# Altium schematic sheet RadarControl_V1.00.SchDoc
size A3
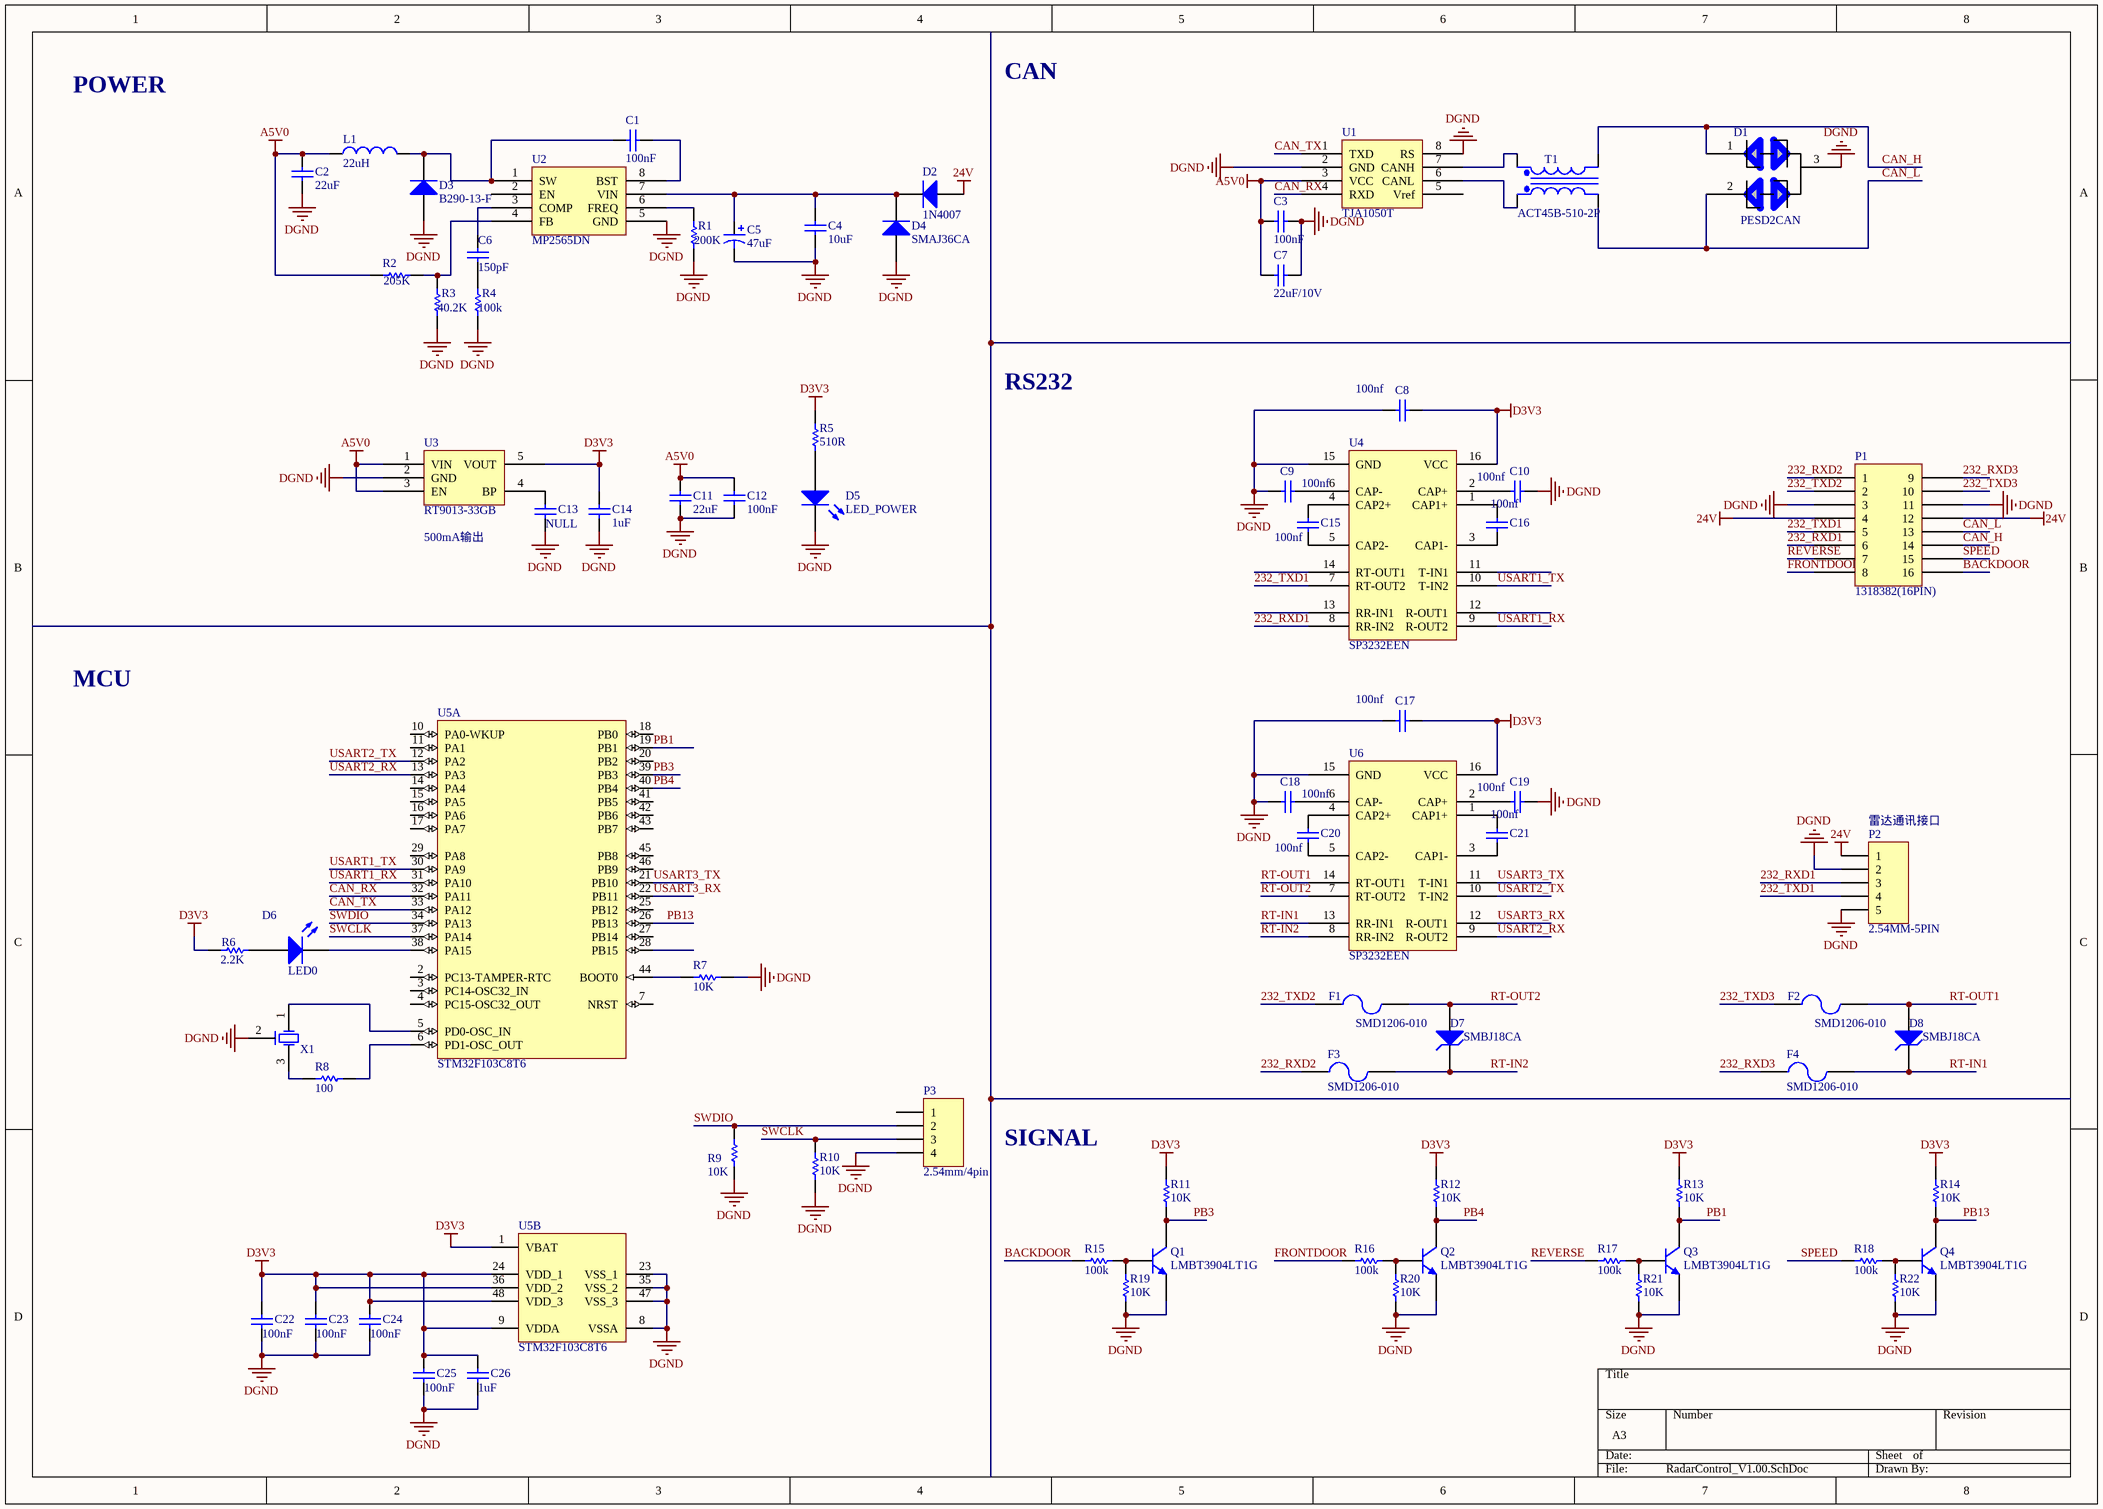
[diagram p0: RadarControl_V1.00.SchDoc]

## Parts
C1  100nF  [0603]
C2  22uF  [0805]
C3  100nF  [0603]
C4  10uF  [0805]
C5  47uF  [cap_pol_8*10.2]
C6  150pF  [0603]
C7  22uF/10V  [0603]
C8  100nf  [0603]
C9  100nf  [0603]
C10  100nf  [0603]
C11  22uF  [1206]
C12  100nF  [0402]
C13  NULL  [0402]
C14  1uF  [0402]
C15  100nf  [0603]
C16  100nf  [0603]
C17  100nf  [0603]
C18  100nf  [0603]
C19  100nf  [0603]
C20  100nf  [0603]
C21  100nf  [0603]
C22  100nF  [0603]
C23  100nF  [0603]
C24  100nF  [0603]
C25  100nF  [0603]
C26  1uF  [0603]
D1  PESD2CAN  [SOT23]
D2  1N4007  [6032_pol]
D3  B290-13-F  [B290]
D4  SMAJ36CA  [B290]
D5  LED_POWER  [0805-LED]
D6  LED0  [0805-LED]
D7  SMBJ18CA  [SMB]
D8  SMBJ18CA  [SMB]
F1  SMD1206-010  [1206]
F2  SMD1206-010  [1206]
F3  SMD1206-010  [1206]
F4  SMD1206-010  [1206]
L1  22uH  [10*10Inductor]
P1  1318382(16PIN)  [16pin 1318382]
P2  2.54MM-5PIN  [HDR1X6]
P3  2.54mm/4pin  [HDR1X4]
Q1  LMBT3904LT1G  [LC-SOT-23(SOT-23-3)]
Q2  LMBT3904LT1G  [LC-SOT-23(SOT-23-3)]
Q3  LMBT3904LT1G  [LC-SOT-23(SOT-23-3)]
Q4  LMBT3904LT1G  [LC-SOT-23(SOT-23-3)]
R1  200K  [0402]
R2  205K  [0603]
R3  40.2K  [0603]
R4  100k  [0603]
R5  510R  [0603]
R6  2.2K  [0603]
R7  10K  [0603]
R8  100  [0603]
R9  value 10K  [0603]  (hidden comment: 1K)
R10  value 10K  [0603]  (hidden comment: 1K)
R11  10K  [0603]
R12  10K  [0603]
R13  10K  [0603]
R14  10K  [0603]
R15  100k  [0603]
R16  100k  [0603]
R17  100k  [0603]
R18  100k  [0603]
R19  10K  [0603]
R20  10K  [0603]
R21  10K  [0603]
R22  10K  [0603]
T1  ACT45B-510-2P  [ACT45B-510-2P]
U1  TJA1050T  [SO8]
U2  MP2565DN  [so-8]
U3  RT9013-33GB  [SOT-23-5]
U4  SP3232EEN  [SO-16]
U5  STM32F103C8T6  [STM-LQFP48_M]  (parts A,B of 2)
U6  SP3232EEN  [SO-16]
X1  8M smd  [8M]  (value not drawn)

## Nets
24V: D2.1(A) P1.4 P1.12 P2.1
A5V0: C2.2 C3.1 C7.1 C11.1 C12.2 L1.1 R2.2 U1.3(VCC) U3.1(VIN) U3.3(EN)
D3V3: C8.2 C14.2 C17.2 C22.2 C23.2 C24.2 C25.2 C26.2 R5.2 R6.2 R11.2 R12.2 R13.2 R14.2 U3.5(VOUT) U4.16(VCC) U5.1(VBAT) U5.9(VDDA) U5.24(VDD_1) U5.36(VDD_2) U5.48(VDD_3) U6.16(VCC)
DGND: C2.1 C3.2 C4.1 C5.2 C7.2 C8.1 C9.1 C10.1 C11.2 C12.1 C13.1 C14.1 C17.1 C18.1 C19.1 C22.1 C23.1 C24.1 C25.1 C26.1 D1.3 D3.1(A) D4.1(A) D5.2(K) P1.3 P1.11 P2.2 P2.5 P3.4 Q1.1(E) Q2.1(E) Q3.1(E) Q4.1(E) R1.1 R3.1 R4.1 R7.2 R9.2 R10.2 R19.1 R20.1 R21.1 R22.1 U1.2(GND) U1.8(RS) U2.5(GND) U3.2(GND) U4.15(GND) U5.8(VSSA) U5.23(VSS_1) U5.35(VSS_2) U5.47(VSS_3) U6.15(GND) X1.2(GND)
232_RXD1: P1.6 P2.3 U4.8(RR-IN2)
232_RXD2: F3.1 P1.1
232_RXD3: F4.1 P1.9
232_TXD1: P1.5 P2.4 U4.7(RT-OUT2)
232_TXD2: F1.1 P1.2
232_TXD3: F2.1 P1.10
BACKDOOR: P1.16 R15.2
CAN_H: D1.1 P1.14 T1.4(Sec-)
CAN_L: D1.2 P1.13 T1.2(Pri-)
CAN_RX: U1.4(RXD) U5.32(PA11)
CAN_TX: U1.1(TXD) U5.33(PA12)
FRONTDOOR: P1.8 R16.2
PB1: Q3.3(C) R13.1 U5.19(PB1)
PB3: Q1.3(C) R11.1 U5.39(PB3)
PB4: Q2.3(C) R12.1 U5.40(PB4)
PB13: Q4.3(C) R14.1 U5.26(PB13)
REVERSE: P1.7 R17.2
RT-IN1: D8.2(K) F4.2 U6.13(RR-IN1)
RT-IN2: D7.2(K) F3.2 U6.8(RR-IN2)
RT-OUT1: D8.1(A) F2.2 U6.14(RT-OUT1)
RT-OUT2: D7.1(A) F1.2 U6.7(RT-OUT2)
SPEED: P1.15 R18.2
SWCLK: P3.3 R10.1 U5.37(PA14)
SWDIO: P3.2 R9.1 U5.34(PA13)
USART1_RX: U4.9(R-OUT2) U5.31(PA10)
USART1_TX: U4.10(T-IN2) U5.30(PA9)
USART2_RX: U5.13(PA3) U6.9(R-OUT2)
USART2_TX: U5.12(PA2) U6.10(T-IN2)
USART3_RX: U5.22(PB11) U6.12(R-OUT1)
USART3_TX: U5.21(PB10) U6.11(T-IN1)
NetC1_1: C1.1 U2.8(BST)
NetC1_2: C1.2 D3.2(K) L1.2 U2.1(SW)
NetC4_2: C4.2 C5.1 D2.2(K) D4.2(K) U2.7(VIN)
NetC6_1: C6.1 U2.3(COMP)
NetC6_2: C6.2 R4.2
NetC9_2: C9.2 U4.6(CAP-)
NetC10_2: C10.2 U4.2(CAP+)
NetC13_2: C13.2 U3.4(BP)
NetC15_1: C15.1 U4.5(CAP2-)
NetC15_2: C15.2 U4.4(CAP2+)
NetC16_1: C16.1 U4.3(CAP1-)
NetC16_2: C16.2 U4.1(CAP1+)
NetC18_2: C18.2 U6.6(CAP-)
NetC19_2: C19.2 U6.2(CAP+)
NetC20_1: C20.1 U6.5(CAP2-)
NetC20_2: C20.2 U6.4(CAP2+)
NetC21_1: C21.1 U6.3(CAP1-)
NetC21_2: C21.2 U6.1(CAP1+)
NetD5_1: D5.1(A) R5.1
NetD6_1: D6.1(A) R6.1
NetD6_2: D6.2(K) U5.38(PA15)
NetQ1_2: Q1.2(B) R15.1 R19.2
NetQ2_2: Q2.2(B) R16.1 R20.2
NetQ3_2: Q3.2(B) R17.1 R21.2
NetQ4_2: Q4.2(B) R18.1 R22.2
NetR1_2: R1.2 U2.6(FREQ)
NetR2_1: R2.1 R3.2 U2.4(FB)
NetR7_1: R7.1 U5.44(BOOT0)
NetR8_1: R8.1 X1.3(OSC2)
NetR8_2: R8.2 U5.6(PD1-OSC_OUT)
NetT1_1: T1.1(Pri+) U1.6(CANL)
NetT1_3: T1.3(Sec+) U1.7(CANH)
NetU5_5: U5.5(PD0-OSC_IN) X1.1(OSC1)

Not connected (* = marked no-connect by the designer): P3 1; U1 5(Vref); U2 2(EN); U4 11(T-IN1) 12(R-OUT1) 13(RR-IN1) 14(RT-OUT1); U5 2(PC13-TAMPER-RTC) 3(PC14-OSC32_IN) 4(PC15-OSC32_OUT) 7(NRST) 10(PA0-WKUP) 11(PA1) 14(PA4) 15(PA5) 16(PA6) 17(PA7) 18(PB0) 20(PB2) 25(PB12) 27(PB14) 28(PB15) 29(PA8) 41(PB5) 42(PB6) 43(PB7) 45(PB8) 46(PB9)

## Notes on the sheet
- POWER
- CAN
- RS232
- (near U3) 500mA输出
- MCU
- (near P2) 雷达通讯接口
- SIGNAL

## Library data of the parts
C1 C6 C11 C13 = Cap: Capacitor; Value: 100pF; Published: 8-Jun-2000; Publisher: Altium Limited
  C1 C6 C13: LatestRevisionDate: 17-Jul-2002; LatestRevisionNote: Re-released for DXP Platform.; PackageReference: RAD-0.3; PackageDescription: Radial Cap, Thru-Hole; 2 Leads; 0.3 in Pin Spacing
  C11: Revision: July-2002: Re-released for DXP Platform.
C2 C4 = Cap: Capacitor,50V; Value: 100pF; Published: 8-Jun-2000; LatestRevisionDate: 17-Jul-2002; LatestRevisionNote: Re-released for DXP Platform.; PackageReference: RAD-0.3; Publisher: Altium Limited; PackageDescription: Radial Cap, Thru-Hole; 2 Leads; 0.3 in Pin Spacing
C3 C22-C26 = Cap: Capacitor; Published: 8-Jun-2000; LatestRevisionDate: 17-Jul-2002; LatestRevisionNote: Re-released for DXP Platform.; PackageReference: RAD-0.3; Publisher: Altium Limited; PackageDescription: Radial Cap, Thru-Hole; 2 Leads; 0.3 in Pin Spacing
  C3 C22-C25: Value: 100nF
  C26: Value: 1uF
C5 = Cap Pol1: Polarized Capacitor (Radial); Value: 100pF; Published: 8-Jun-2000; LatestRevisionDate: 17-Jul-2002; LatestRevisionNote: Re-released for DXP Platform.; PackageReference: RB7.6-15; Publisher: Altium Limited; PackageDescription: Polarized Capacitor (Radial); 2 Leads
C7 = Cap: Capacitor; Value: 22uF; Published: 8-Jun-2000; Revision: July-2002: Re-released for DXP Platform.; Publisher: Altium Limited
C8-C10 C15-C21 = Cap: Capacitor; Value: 0.1uF; Published: 8-Jun-2000; LatestRevisionDate: 17-Jul-2002; LatestRevisionNote: Re-released for DXP Platform.; PackageReference: RAD-0.3; Publisher: Altium Limited
C12 = Cap: Capacitor 5V; Value: 100pF; Published: 8-Jun-2000; LatestRevisionDate: 17-Jul-2002; LatestRevisionNote: Re-released for DXP Platform.; PackageReference: RAD-0.3; Publisher: Altium Limited; PackageDescription: Radial Cap, Thru-Hole; 2 Leads; 0.3 in Pin Spacing
C14 = Cap: Capacitor 3V3; Value: 100pF; Published: 8-Jun-2000; LatestRevisionDate: 17-Jul-2002; LatestRevisionNote: Re-released for DXP Platform.; PackageReference: RAD-0.3; Publisher: Altium Limited; PackageDescription: Radial Cap, Thru-Hole; 2 Leads; 0.3 in Pin Spacing
D1 = PESD1CAN
D2 = Diode 1N4007: 1 Amp General Purpose Rectifier; Published: 8-Jun-2000; LatestRevisionDate: 17-Jul-2002; LatestRevisionNote: Re-released for DXP Platform.; DatasheetVersion: 1998; PackageVersion: Aug-1999; PackageReference: DO-41; Publisher: Altium Limited; PackageDescription: Diode, Axial; Body 5.2 x 2.7 mm (LxDia. max), Lead Dia. 0.86 mm (max); Code_JEDEC: DO-204-AL; ComponentLink1Description: Manufacturer Link; ComponentLink1URL: http://www.fairchildsemi.com/; ComponentLink2Description: Datasheet; ComponentLink2URL: http://www.fairchildsemi.com/ds/1N%2F1N4001.pdf
D3 = Diode: Default Diode; Published: 8-Jun-2000; LatestRevisionDate: 17-Jul-2002; LatestRevisionNote: Re-released for DXP Platform.; PackageVersion: Sep-1996; PackageReference: SMC; Publisher: Altium Limited; PackageDescription: DO-214-AB/SMC; 2 C-Bend Leads; Body 7.9 x 5.9 mm, inc. leads (LxW); Code_JEDEC: DO-214-AB
D4 = Diode 1N4007: 1 Amp General Purpose Rectifier; pin to pad: 1>2 2>1; Published: 8-Jun-2000; LatestRevisionDate: 17-Jul-2002; LatestRevisionNote: Re-released for DXP Platform.; DatasheetVersion: 1998; PackageVersion: Aug-1999; PackageReference: DO-41; Publisher: Altium Limited; PackageDescription: Diode, Axial; Body 5.2 x 2.7 mm (LxDia. max), Lead Dia. 0.86 mm (max); Code_JEDEC: DO-204-AL; ComponentLink1Description: Manufacturer Link; ComponentLink1URL: http://www.fairchildsemi.com/; ComponentLink2Description: Datasheet; ComponentLink2URL: http://www.fairchildsemi.com/ds/1N%2F1N4001.pdf
D5 = LED0: Typical INFRARED GaAs LED; Published: 8-Jun-2000; LatestRevisionDate: 08-Jul-2005; LatestRevisionNote: Mech Layer 1 removed.; PackageReference: LED-0; Publisher: Altium Limited; PackageDescription: LED; 2 Leads
D6 = LED0: green LED; Published: 8-Jun-2000; LatestRevisionDate: 08-Jul-2005; LatestRevisionNote: Mech Layer 1 removed.; PackageReference: LED-0; Publisher: Altium Limited; PackageDescription: LED; 2 Leads
D7 D8 = D Zener: Zener Diode; Published: 8-Jun-2000; LatestRevisionDate: 17-Jul-2002; LatestRevisionNote: Re-released for DXP Platform.; PackageReference: DIODE-0.7; Publisher: Altium Limited; PackageDescription: Diode, Thru-Hole; 2 Leads; 0.7 in Pin Spacing
F1-F4 = Fuse 2: Fuse; Published: 8-Jun-2000; LatestRevisionDate: 17-Jul-2002; LatestRevisionNote: Re-released for DXP Platform.; PackageReference: PIN-W2/E2.8; Publisher: Altium Limited; PackageDescription: Thru-Hole; 2 Leads
L1 = Inductor: Inductor, 1A; Code_IEC: 1005; Value: 15uH; Published: 8-Jun-2000; LatestRevisionDate: 29-May-2009; LatestRevisionNote: IPC-7351 Footprint Added.; PackageReference: 0402-A; Publisher: Altium Limited; PackageDescription: Chip Inductor; Code_JEITA: 0402
P1 = 16PIN
P2 = Header 5: Header, 5-Pin; LatestRevisionDate: 17-Jul-2002; LatestRevisionNote: Re-released for DXP Platform.; Publisher: Altium Limited
P3 = Header 4: Header, 4-Pin; LatestRevisionDate: 17-Jul-2002; LatestRevisionNote: Re-released for DXP Platform.; Publisher: Altium Limited
Q1-Q4 = 2N3904: NPN General Purpose Amplifier; Published: 8-Jun-2000; LatestRevisionDate: 15-Jan-2003; LatestRevisionNote: PCB Footprint 'BCY-W3/D4.7' replaced; DatasheetVersion: 1997; PackageVersion: Sep-1998; PackageReference: TO-92A; Publisher: Altium Limited; PackageDescription: TO, Flat Index; 3 In-Line, Axial Leads; Body Dia. 4.5mm; Leads 0.51 x 0.48 mm (max); ComponentLink1Description: Manufacturer Link; ComponentLink1URL: http://www.fairchildsemi.com/; ComponentLink2Description: Datasheet; ComponentLink2URL: http://www.fairchildsemi.com/ds/2N%2F2N3904.pdf
R1 R3 R6-R14 R19-R22 = Res1: Resistor; Published: 8-Jun-2000; LatestRevisionDate: 17-Jul-2002; LatestRevisionNote: Re-released for DXP Platform.; PackageReference: AXIAL-0.3; Publisher: Altium Limited
  R1: Value: 200K
  R3: Value: 40.2K
  R6: Value: 2.2K
  R7 R11-R14 R19-R22: PackageDescription: Axial Device, Thru-Hole; 2 Leads; 0.3 in Pin Spacing; Value: 10K
  R8: PackageDescription: Axial Device, Thru-Hole; 2 Leads; 0.3 in Pin Spacing; Value: 100
R2 = Res1: Resistor; Value: 210K; Published: 8-Jun-2000; LatestRevisionDate: 17-Jul-2002; LatestRevisionNote: Re-released for DXP Platform.; PackageReference: AXIAL-0.3; Publisher: Altium Limited
R4 R15-R18 = Res1: Resistor; Value: 47.5K; Published: 8-Jun-2000; LatestRevisionDate: 17-Jul-2002; LatestRevisionNote: Re-released for DXP Platform.; PackageReference: AXIAL-0.3; Publisher: Altium Limited
R5 = Res1: Resistor; Value: 1K; Published: 8-Jun-2000; LatestRevisionDate: 17-Jul-2002; LatestRevisionNote: Re-released for DXP Platform.; PackageReference: AXIAL-0.3; Publisher: Altium Limited; PackageDescription: Axial Device, Thru-Hole; 2 Leads; 0.3 in Pin Spacing
T1 = Trans Eq: Transformer (Equivalent Circuit Model); Published: 8-Jun-2000; LatestRevisionDate: 17-Jul-2002; LatestRevisionNote: Re-released for DXP Platform.; PackageReference: TRF_4; Publisher: Altium Limited; PackageDescription: Transformer; 4 Leads
U1 = TJA1050T: CAN Tranceiver
U2 = MP1584: DCDC 4.5V~28V input 1.8V ~5V output low power; Manufacture: MPS
U3 = RT9193
U4 U6 = MAX202
U5 = STM32F103C8T6: ARM Cortex-M3 32-bit MCU, 64 KB Flash, 20 KB Internal RAM, 37 I/Os, 48-pin LQFP, -40 to 85 degC, Tray; A/D Converter: 2x12-bit (10 Channel); FLASH Size (Prog) (kB): 64; I/Os (High Current): 37; Internal RAM Size (kB): 20; Operating Frequency(F) (Processor speed) (MHz): 72; Supply Voltage(Vcc) min (V): 2; DatasheetVersion: Rev. 16; PackageVersion: Rev. 6, 06/2013; PackageReference: LQFP48; PackageDescription: 48-Pin Low Profile Quad Flat Package, 7 x 7 mm Body, 0.5 mm Pitch; Supplier 1: Digi-Key; Supplier Part Number 1: 497-6063-ND; Supplier 2: Farnell; Supplier Part Number 2: 1447637; Supplier 3: Newark; Supplier Part Number 3: 59M2182; Supplier 4: Newark; Supplier Part Number 4: 57P1222; Supplier 5: Mouser; Supplier Part Number 5: 511-STM32F103C8T6; Core: ARM Cortex-M3; Packing: Tray; Mounting Technology: Surface Mount; PartNumber: STM32F103C8T6; ComponentLink1Description: Manufacturer URL; ComponentLink1URL: http://www.st.com/web/en/home.html; ComponentLink2Description: Datasheet; ComponentLink2URL: http://www.st.com/st-web-ui/static/active/en/resource/technical/document/datasheet/CD00161566.pdf; ComponentLink3Description: Package Specification; ComponentLink3URL: http://www.st.com/st-web-ui/static/active/en/resource/technical/document/datasheet/DM00058181.pdf